# EAGLE design ADC Scaling (EAGLE 7.1.0)
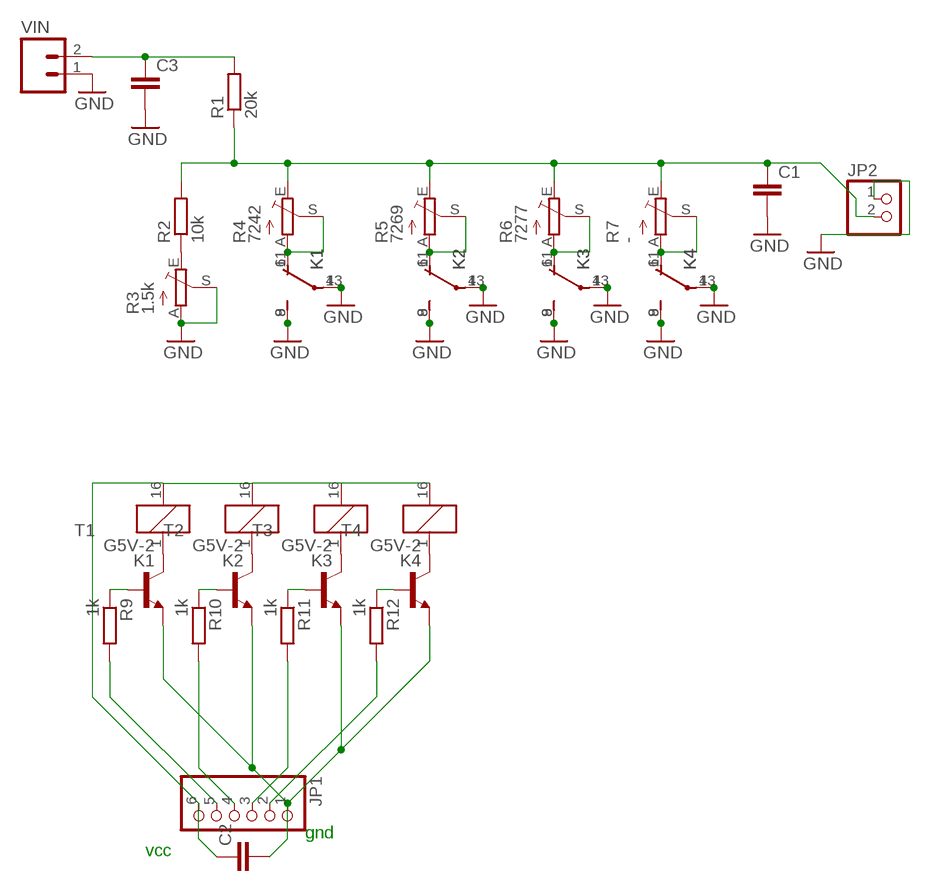
[diagram p0: schematic, sheet 1]

## Parts
C1  C-EUC0805  [C0805]
C2  C-EUC0805  [C0805]
C3  C-EUC0805  [C0805]
JP1  PINHD-1X6  [1X06]
JP2  PINHD-1X2  [1X02]
K1  G5V-2  [G5V-2]
K2  G5V-2  [G5V-2]
K3  G5V-2  [G5V-2]
K4  G5V-2  [G5V-2]
R1  20k  R-EU_M0805  [M0805]
R2  10k  R-EU_M0805  [M0805]
R3  1.5k  TRIM_EU-RJ9W  [RJ9W]
R4  7242  TRIM_EU-RJ9W  [RJ9W]
R5  7269  TRIM_EU-RJ9W  [RJ9W]
R6  7277  TRIM_EU-RJ9W  [RJ9W]
R7  -  TRIM_EU-RJ9W  [RJ9W]
R9  1k  R-EU_M0805  [M0805]
R10  1k  R-EU_M0805  [M0805]
R11  1k  R-EU_M0805  [M0805]
R12  1k  R-EU_M0805  [M0805]
T1  MMBTA42LT1-NPN-SOT23-BEC  [SOT23-BEC]
T2  MMBTA42LT1-NPN-SOT23-BEC  [SOT23-BEC]
T3  MMBTA42LT1-NPN-SOT23-BEC  [SOT23-BEC]
T4  MMBTA42LT1-NPN-SOT23-BEC  [SOT23-BEC]
VIN  M02POLAR  [MOLEX-1X2]

## Nets
GND: C1.2 C3.2 JP2.1 K1.4(1:P) K1.8(1:S) K1.9(2:S) K1.13(2:P) K2.4(1:P) K2.8(1:S) K2.9(2:S) K2.13(2:P) K3.4(1:P) K3.8(1:S) K3.9(2:S) K3.13(2:P) K4.4(1:P) K4.8(1:S) K4.9(2:S) K4.13(2:P) R3.A R3.S VIN.1
GND2: C2.2 JP1.1 T1.E T2.E T3.E T4.E
N$1: R2.1 R3.E
N$2: C3.1 R1.2 VIN.2
N$4: K1.1 T1.C
N$5: K2.1 T2.C
N$6: K2.6(1:O) K2.11(2:O) R5.A R5.S
N$7: K1.6(1:O) K1.11(2:O) R4.A R4.S
N$8: K3.1 T3.C
N$9: K4.1 T4.C
N$11: R12.1 T4.B
N$12: R11.1 T3.B
N$14: R10.1 T2.B
N$15: R9.1 T1.B
N$17: K3.6(1:O) K3.11(2:O) R6.A R6.S
N$18: C2.1 JP1.6 K1.16 K2.16 K3.16 K4.16
N$20: K4.6(1:O) K4.11(2:O) R7.A R7.S
N$21: C1.1 JP2.2 R1.1 R2.2 R4.E R5.E R6.E R7.E
N$22: JP1.5 R9.2
N$23: JP1.4 R10.2
N$24: JP1.3 R11.2
N$25: JP1.2 R12.2

## Notes on the sheet
- gnd
- vcc

## Library data of the parts
C1-C3 = resistor:C-EU: CAPACITOR, European symbol; SPICEPREFIX: C
JP1 = pinhead:PINHD-1X6: PIN HEADER
JP2 = pinhead:PINHD-1X2: PIN HEADER
K1-K4 = relay:G5V-2: OMRON PCB Relay Source: http://www.omron.com/ecb/products/pdf/en-g5v2.pdf; MPN: G5V-2 5DC; OC_FARNELL: 9949488; OC_NEWARK: 78K5703
R1 R2 R9-R12 = resistor:R-EU_: RESISTOR, European symbol; SPICEPREFIX: R
R3-R7 = pot:TRIM_EU-: POTENTIOMETER
T1-T4 = transistor:*-NPN-: NPN Transistror BF959 corrected 2008.03.06
VIN = SparkFun:M02: Header 2 Standard 2-pin 0.1" header. Use with straight break away headers (SKU : PRT-00116), right angle break away headers (PRT-00553), swiss pins (PRT-00743), machine pins (PRT-00117), and female headers (PRT-00115). Molex polarized connector foot print use with SKU : PRT-08233 with associated crimp pins and housings.

## Board
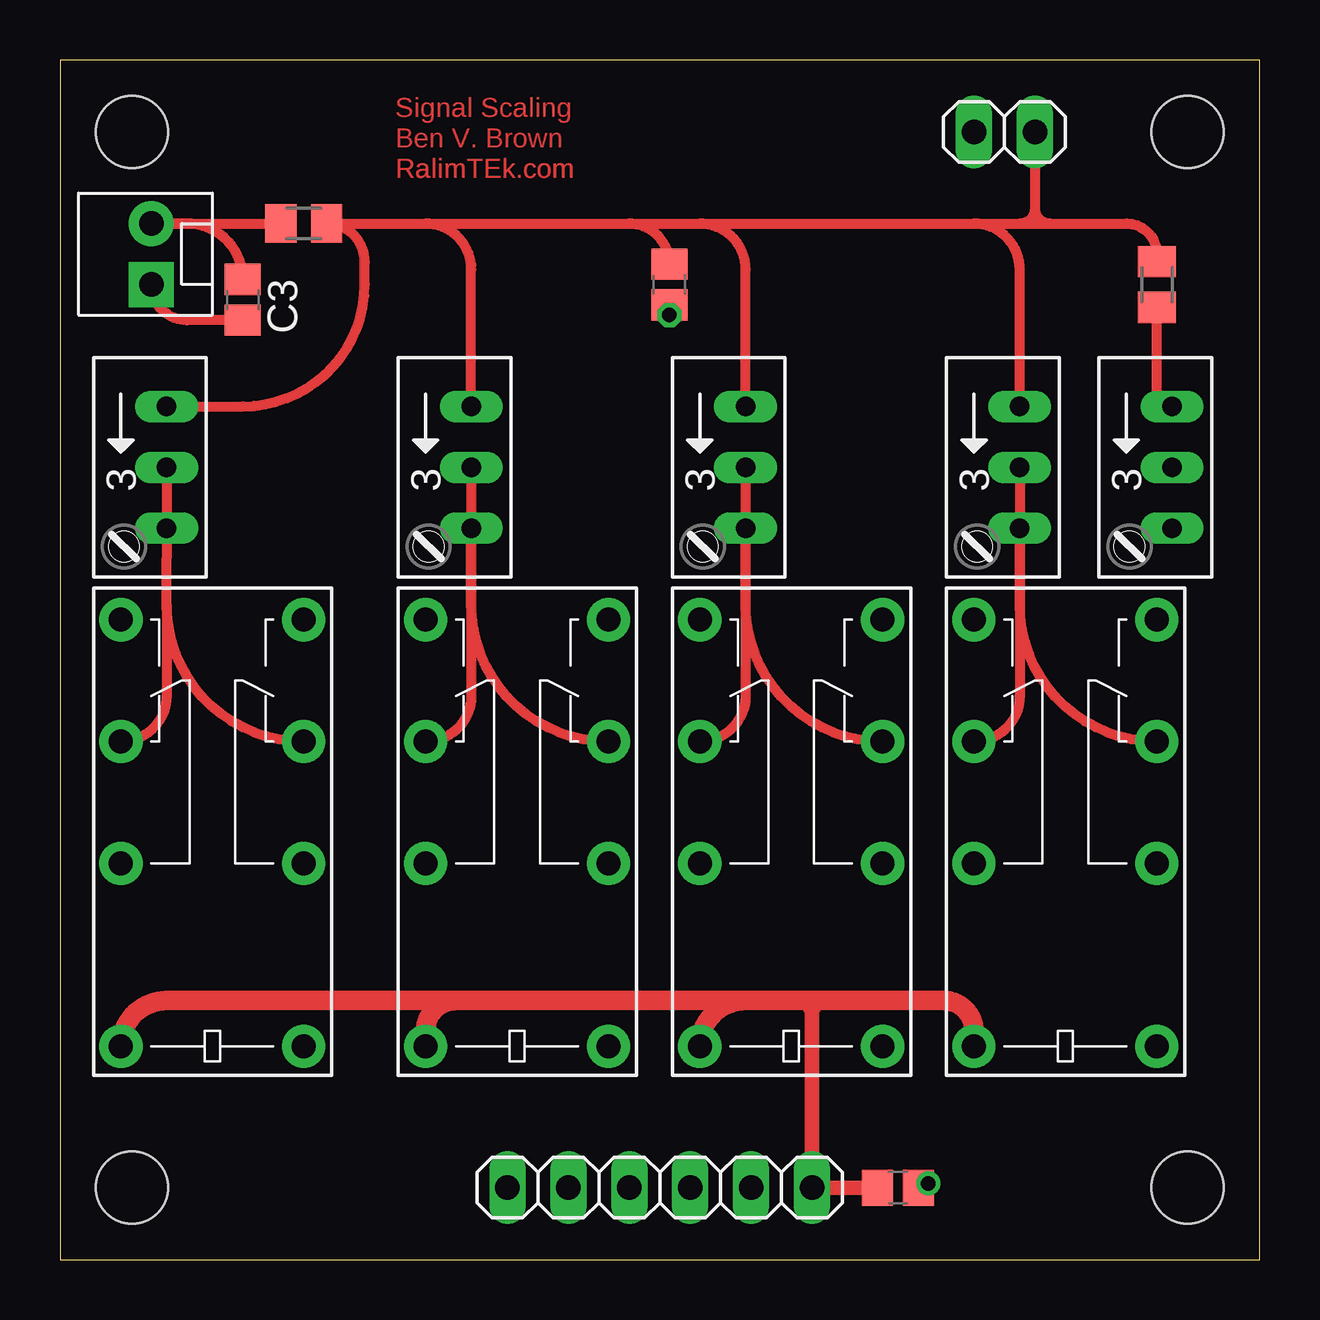
[diagram p1: board, top side]
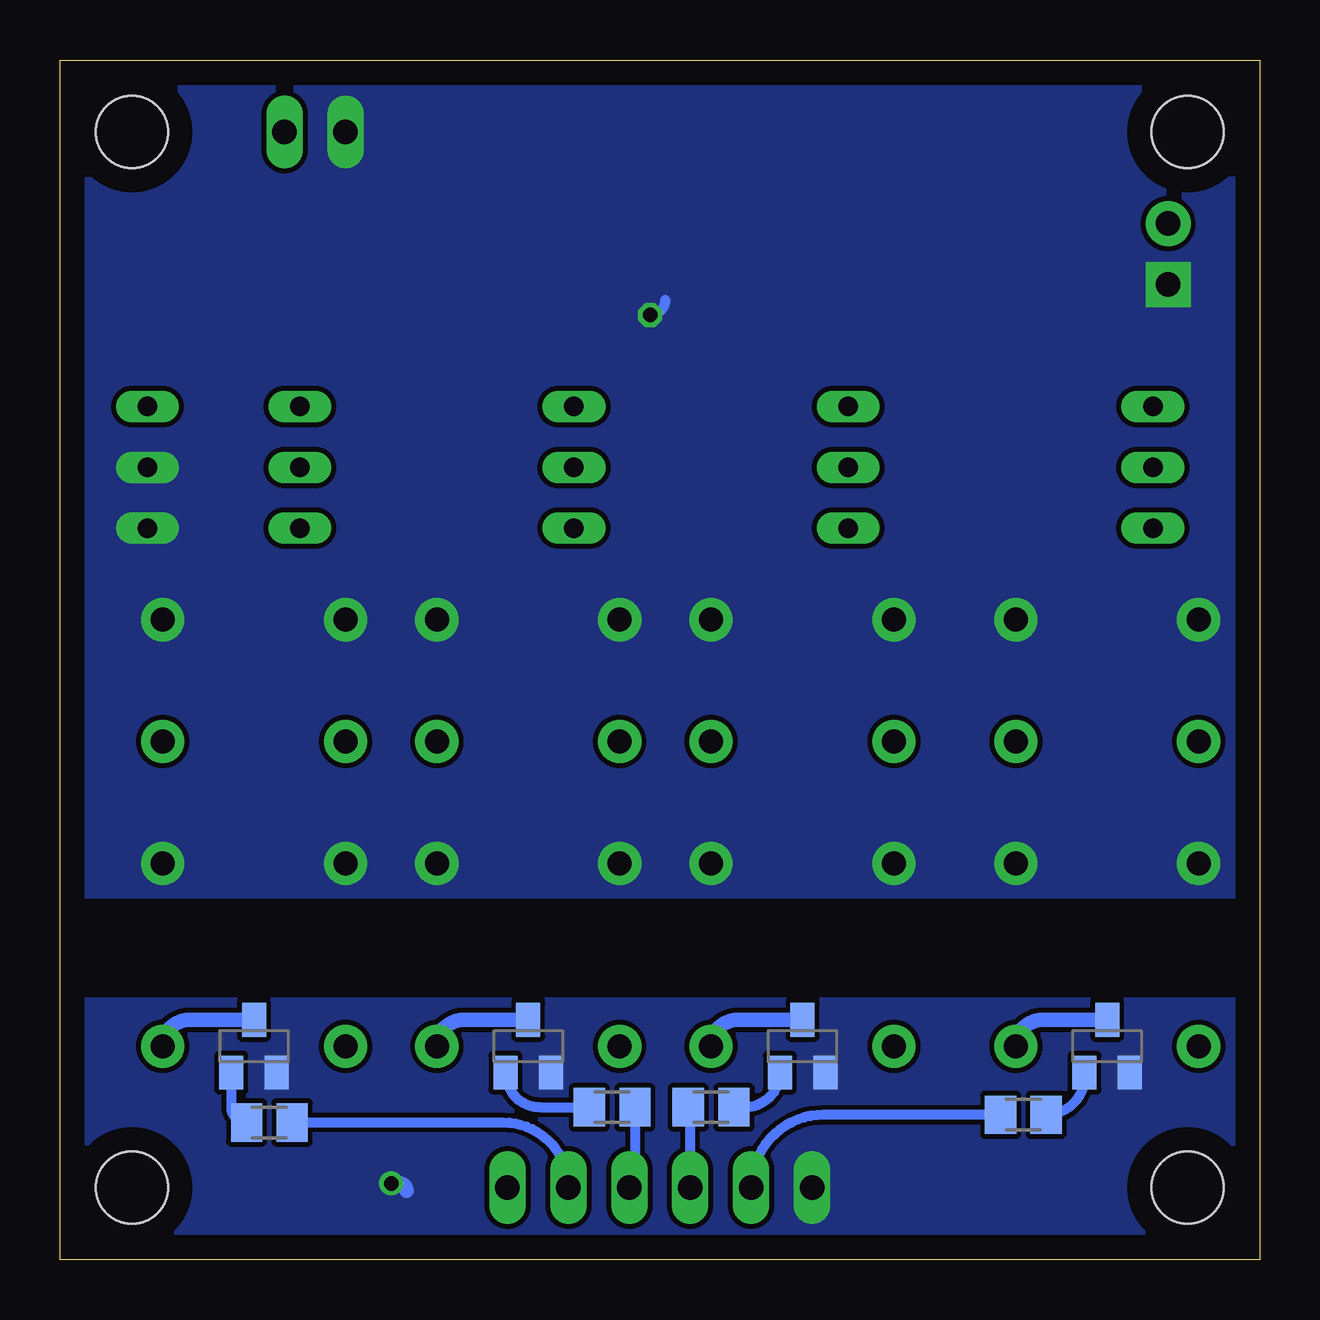
[diagram p2: board, bottom side, seen from below]

Size 50 x 50 mm. Coordinates in mm from the lower left corner, seen from the top.
Outline: 0,0 50,0 50,50 0,50 0,0
Copper layers (1*16): Top 0.035mm / dielectric 1.5mm / Bottom 0.035mm
Design rules "default": minimum track width 10mil, minimum drill 24mil, track to track 8mil, track to pad 8mil, pad to pad 8mil, via to via 8mil, smd to smd 8mil, copper to edge 40mil, drill to drill 8mil, minimum pad ring 10mil, minimum via ring 8mil, stop-mask expansion 4mil, vias tented up to drill 0mil, thermal gap 10mil
Holes 3 mm at 3,3 47,3 47,47 3,47

### Footprints (pad centres in the part's own frame; a part is rotated, then mirrored left to right if it is on the bottom)
C0805 = smd 1.3 x 1.5: 1 -0.85,0; 2 0.85,0
1X06 = drill 1.016 long: 1 -6.35,0; 2 -3.81,0; 3 -1.27,0; 4 1.27,0; 5 3.81,0; 6 6.35,0
1X02 = drill 1.016 long: 1 -1.27,0; 2 1.27,0
G5V-2 = drill 1 pad 1.8: 1 -8.89,-3.81; 4 -1.27,-3.81; 6 3.81,-3.81; 8 8.89,-3.81; 9 8.89,3.81; 11 3.81,3.81; 13 -1.27,3.81; 16 -8.89,3.81
M0805 = smd 1.3 x 1.6: 1 -0.95,0; 2 0.95,0
RJ9W = drill 0.813 long: A 2.54,0.635; E -2.54,0.635; S 0,0.635
SOT23-BEC = smd 1 x 1.4: B -0.95,-1.1; C 0,1.1; E 0.95,-1.1
MOLEX-1X2 = drill 1.016 pad 1.88 square: 1 0,0 | drill 1.016 pad 1.88: 2 2.54,0

### Placement (x,y rotation side)
C1  25.4,40.64 270 top
C2  34.92,3 0 top
C3  7.62,40.01 270 top
JP1  25,3 0 top
JP2  39.37,47 0 top
K1  41.91,17.78 90 top
K2  30.48,17.78 90 top
K3  19.05,17.78 90 top
K4  6.35,17.78 90 top
R1  10.16,43.18 180 top
R2  45.72,40.64 90 top
R3  45.72,33.02 270 top
R4  39.37,33.02 270 top
R5  27.94,33.02 270 top
R6  16.51,33.02 270 top
R7  3.81,33.02 270 top
R9  41.27,5.71 0 bottom
R10  26.99,6.35 0 bottom
R11  22.86,6.35 180 bottom
R12  9.84,6.03 180 bottom
T1  41.91,8.89 0 bottom
T2  30.48,8.89 0 bottom
T3  19.05,8.89 0 bottom
T4  6.35,8.89 0 bottom
VIN  3.81,40.64 90 top

### Tracks (layer width: path | path; a pad name or v marks a point on that pad's centre or on a via)
GND  (via drill 0.6)
  Top 0.406: C1.2 v25.4,39.37 | C3.2 5.29,39.16 arc-90 VIN.1
  Bottom 0.406: v25.4,39.37 arc-90 24.77,40.01
  pour Bottom (no thermals): 0,15.24 50.8,15.24 50.8,50.8 0,50.8
GND2  (via drill 0.6)
  Top 0.61: C2.2 36.02,3 arc90 v36.2,3.17
  Bottom 0.61: v36.2,3.17 35.88,3.17 arc90 35.56,2.86
  pour Bottom (no thermals): 0,10.79 50.16,10.79 50.16,-0.64 -0.64,-0.64 -0.64,10.79
N$1
  Top 0.406: R3.E arc-90 45.72,36.2 R2.1
N$2
  Top 0.406: R1.2 VIN.2 5.29,43.18 arc-90 C3.1
N$4
  Bottom 0.61: T1.C 44.62,9.99 arc-90 K1.1
N$5
  Bottom 0.61: T2.C 33.19,9.99 arc-90 K2.1
N$6
  Top 0.406: R5.A 28.57,23.5 arc-90 K2.11 | R5.S R5.A | K2.6 arc-90 28.57,27.3 R5.A
N$7
  Top 0.406: R4.A 40.01,23.5 arc-90 K1.11 | R4.S R4.A | K1.6 arc-90 40.01,27.3 R4.A
N$8
  Bottom 0.61: T3.C 21.76,9.99 arc-90 K3.1
N$9
  Bottom 0.61: T4.C 9.06,9.99 arc-90 K4.1
N$11
  Bottom 0.406: T4.B 7.3,7.62 arc90 R12.1
N$12
  Bottom 0.406: 21.74,6.52 arc-90 R11.1 21.44,6.35 arc-90 T3.B
N$14
  Bottom 0.406: T2.B arc-90 29.99,6.35 R10.1
N$15
  Bottom 0.406: T1.B 42.86,6.35 arc-90 R9.1
N$17
  Top 0.406: R6.A 17.14,23.5 arc-90 K3.11 | R6.S R6.A | K3.6 arc-90 17.14,27.3 R6.A
N$18
  Top 0.61: 31.11,10.79 arc-90 31.35,10.56 JP1.6 C2.1
  Top 0.813: K1.16 38.1,9.53 arc90 36.83,10.79 31.11,10.79 | 31.11,10.79 28.57,10.79 | 28.57,10.79 16.51,10.79 | 16.51,10.79 4.45,10.79 arc90 K4.16 | K3.16 15.24,9.53 arc-90 16.51,10.79 | K2.16 arc-90 28.57,10.79 | 31.35,10.56 arc90 31.11,10.79
N$20
  Top 0.406: R7.S R7.A 4.45,29.21 4.45,27.3 | 4.45,27.3 4.45,23.5 arc-90 K4.11 | K4.6 arc-90 4.45,27.3
N$21
  Top 0.406: 15.24,43.18 R1.1 arc-90 12.7,41.59 12.7,40.64 arc-90 7.62,35.56 R7.E | 15.24,43.18 23.71,43.18 | 23.71,43.18 26.67,43.18 | 26.67,43.18 38.1,43.18 | 38.1,43.18 40.01,43.18 | 40.01,43.18 41.27,43.18 | 41.27,43.18 44.45,43.18 arc-90 45.72,41.91 R2.2 | R4.E 40.01,41.27 arc90 38.1,43.18 | R5.E 28.57,41.27 arc90 26.67,43.18 | R6.E 17.14,41.27 arc90 15.24,43.18 | C1.1 arc90 23.71,43.18 | 40.64,43.81 arc-90 40.01,43.18 | JP2.2 40.64,43.81 | 40.64,43.81 arc90 41.27,43.18
N$22
  Bottom 0.406: R9.2 31.52,5.71 arc90 JP1.5
N$23
  Bottom 0.406: R10.2 26.04,3.23 arc90 JP1.4
N$24
  Bottom 0.406: R11.2 arc90 23.73,6.27 JP1.3
N$25
  Bottom 0.406: R12.2 18.16,6.03 arc-90 JP1.2

### Text on the board
Top: Signal Scaling | Ben V. Brown | RalimTEk.com | RalimTEk.com
tRestrict: Signal Scaling | Ben V. Brown | RalimTEk.com